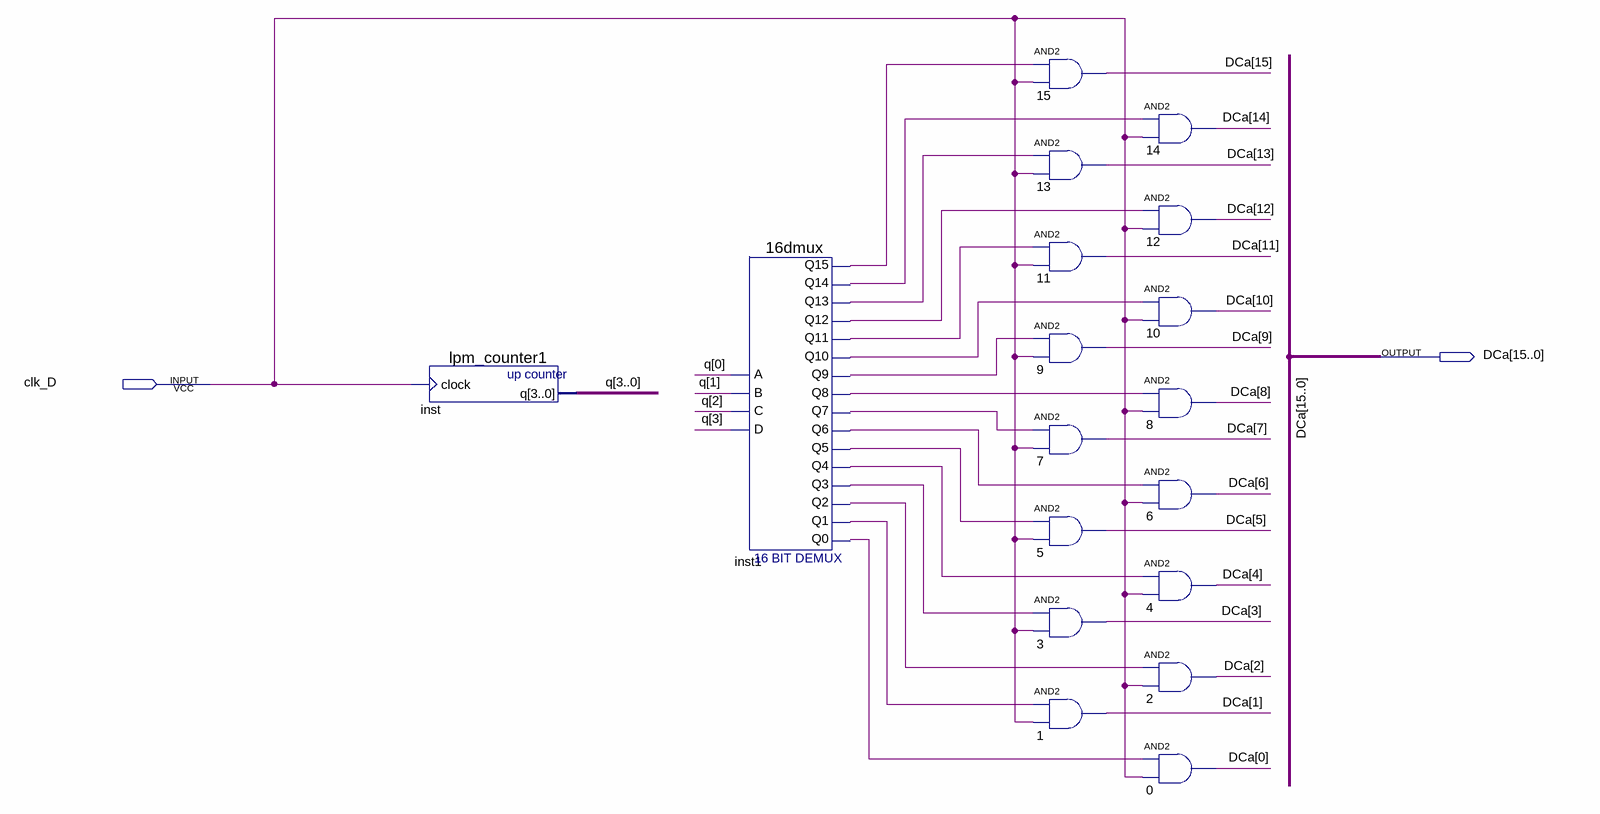
[diagram p0: schematic sheet]
// Quartus schematic lab2_block3.bdf as structural Verilog: 18 symbols, 2 pins
module lab2_block3 (
  input  clk_D,
  output [15:0] DCa
);

  wire inst1_q0, inst1_q1, inst1_q2, inst1_q3, inst1_q4, inst1_q5, inst1_q6, inst1_q7, inst1_q8, inst1_q9,
       inst1_q10, inst1_q11, inst1_q12, inst1_q13, inst1_q14, inst1_q15;
  wire [3:0] q;

  lpm_counter1 inst (.clock(clk_D), .q(q));
  \16dmux  inst1 (
    .C(q[2]), .B(q[1]), .A(q[0]), .D(q[3]), .Q12(inst1_q12), .Q13(inst1_q13), .Q11(inst1_q11), .Q9(inst1_q9),
    .Q10(inst1_q10), .Q7(inst1_q7), .Q8(inst1_q8), .Q4(inst1_q4), .Q5(inst1_q5), .Q6(inst1_q6),
    .Q2(inst1_q2), .Q3(inst1_q3), .Q14(inst1_q14), .Q15(inst1_q15), .Q0(inst1_q0), .Q1(inst1_q1));
  and u_15 (DCa[15], inst1_q15, clk_D);
  and u_13 (DCa[13], inst1_q13, clk_D);
  and u_11 (DCa[11], inst1_q11, clk_D);
  and u_9 (DCa[9], inst1_q9, clk_D);
  and u_7 (DCa[7], inst1_q7, clk_D);
  and u_5 (DCa[5], inst1_q5, clk_D);
  and u_3 (DCa[3], inst1_q3, clk_D);
  and u_1 (DCa[1], inst1_q1, clk_D);
  and u_14 (DCa[14], inst1_q14, clk_D);
  and u_12 (DCa[12], inst1_q12, clk_D);
  and u_10 (DCa[10], inst1_q10, clk_D);
  and u_8 (DCa[8], inst1_q8, clk_D);
  and u_6 (DCa[6], inst1_q6, clk_D);
  and u_4 (DCa[4], inst1_q4, clk_D);
  and u_2 (DCa[2], inst1_q2, clk_D);
  and u_0 (DCa[0], inst1_q0, clk_D);
endmodule
